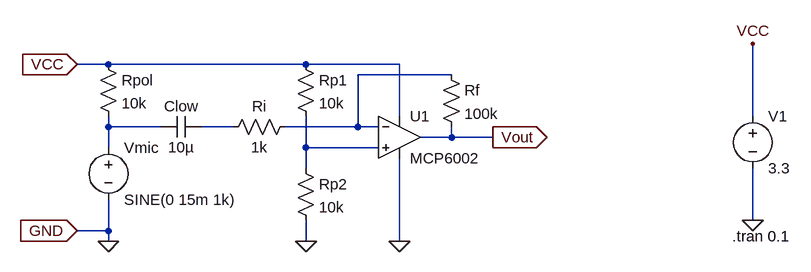
[diagram p0: schematic amplif_mic.asc]
amplif_mic.asc, the LTspice schematic file:
Version 4
SHEET 1 2152 680
WIRE 128 16 80 16
WIRE 432 16 128 16
WIRE 576 16 432 16
WIRE 656 32 512 32
WIRE 576 96 576 16
WIRE 1120 96 1120 -16
WIRE 128 112 128 96
WIRE 208 112 128 112
WIRE 320 112 272 112
WIRE 512 112 512 32
WIRE 512 112 400 112
WIRE 544 112 512 112
WIRE 656 128 656 112
WIRE 656 128 608 128
WIRE 720 128 656 128
WIRE 128 144 128 112
WIRE 432 144 432 96
WIRE 544 144 432 144
WIRE 432 176 432 144
WIRE 1120 256 1120 176
WIRE 128 272 128 224
WIRE 128 272 80 272
WIRE 128 288 128 272
WIRE 432 288 432 256
WIRE 576 288 576 160
FLAG 1120 256 0
FLAG 128 288 0
FLAG 576 288 0
FLAG 80 16 VCC
IOPIN 80 16 In
FLAG 1120 -16 VCC
FLAG 720 128 Vout
IOPIN 720 128 Out
FLAG 80 272 GND
IOPIN 80 272 In
FLAG 432 288 0
SYMBOL voltage 1120 80 R0
WINDOW 123 0 0 Left 2
WINDOW 39 0 0 Left 2
SYMATTR InstName V1
SYMATTR Value 3.3
SYMBOL voltage 128 128 R0
WINDOW 123 0 0 Left 2
WINDOW 39 0 0 Left 2
SYMATTR InstName Vmic
SYMATTR Value SINE(0 15m 1k)
SYMBOL res 416 96 R90
WINDOW 0 0 56 VBottom 2
WINDOW 3 32 56 VTop 2
SYMATTR InstName Ri
SYMATTR Value 1k
SYMBOL cap 272 96 R90
WINDOW 0 0 32 VBottom 2
WINDOW 3 32 32 VTop 2
SYMATTR InstName Clow
SYMATTR Value 10µ
SYMBOL res 416 160 R0
SYMATTR InstName Rp2
SYMATTR Value 10k
SYMBOL res 416 0 R0
SYMATTR InstName Rp1
SYMATTR Value 10k
SYMBOL res 112 0 R0
SYMATTR InstName Rpol
SYMATTR Value 10k
SYMBOL res 640 16 R0
SYMATTR InstName Rf
SYMATTR Value 100k
SYMBOL Opamps\\opamp2 576 64 R0
SYMATTR InstName U1
SYMATTR Value MCP6002
TEXT 1088 280 Left 2 !.tran 0.1

The netlist it stands for:
* amplif_mic.asc
V1 VCC 0 3.3
Vmic N002 0 SINE(0 15m 1k)
Ri N001 N003 1k
Clow N003 N002 10µ
Rp2 N004 0 10k
Rp1 VCC N004 10k
Rpol VCC N002 10k
Rf N001 Vout 100k
XU1 N004 N001 VCC 0 Vout MCP6002  ; pins In+ In- V+ V- OUT
.tran 0.1
.backanno
.end